# Altium project 50ohm-diff_converter.PrjPcb (part 1 of 3)
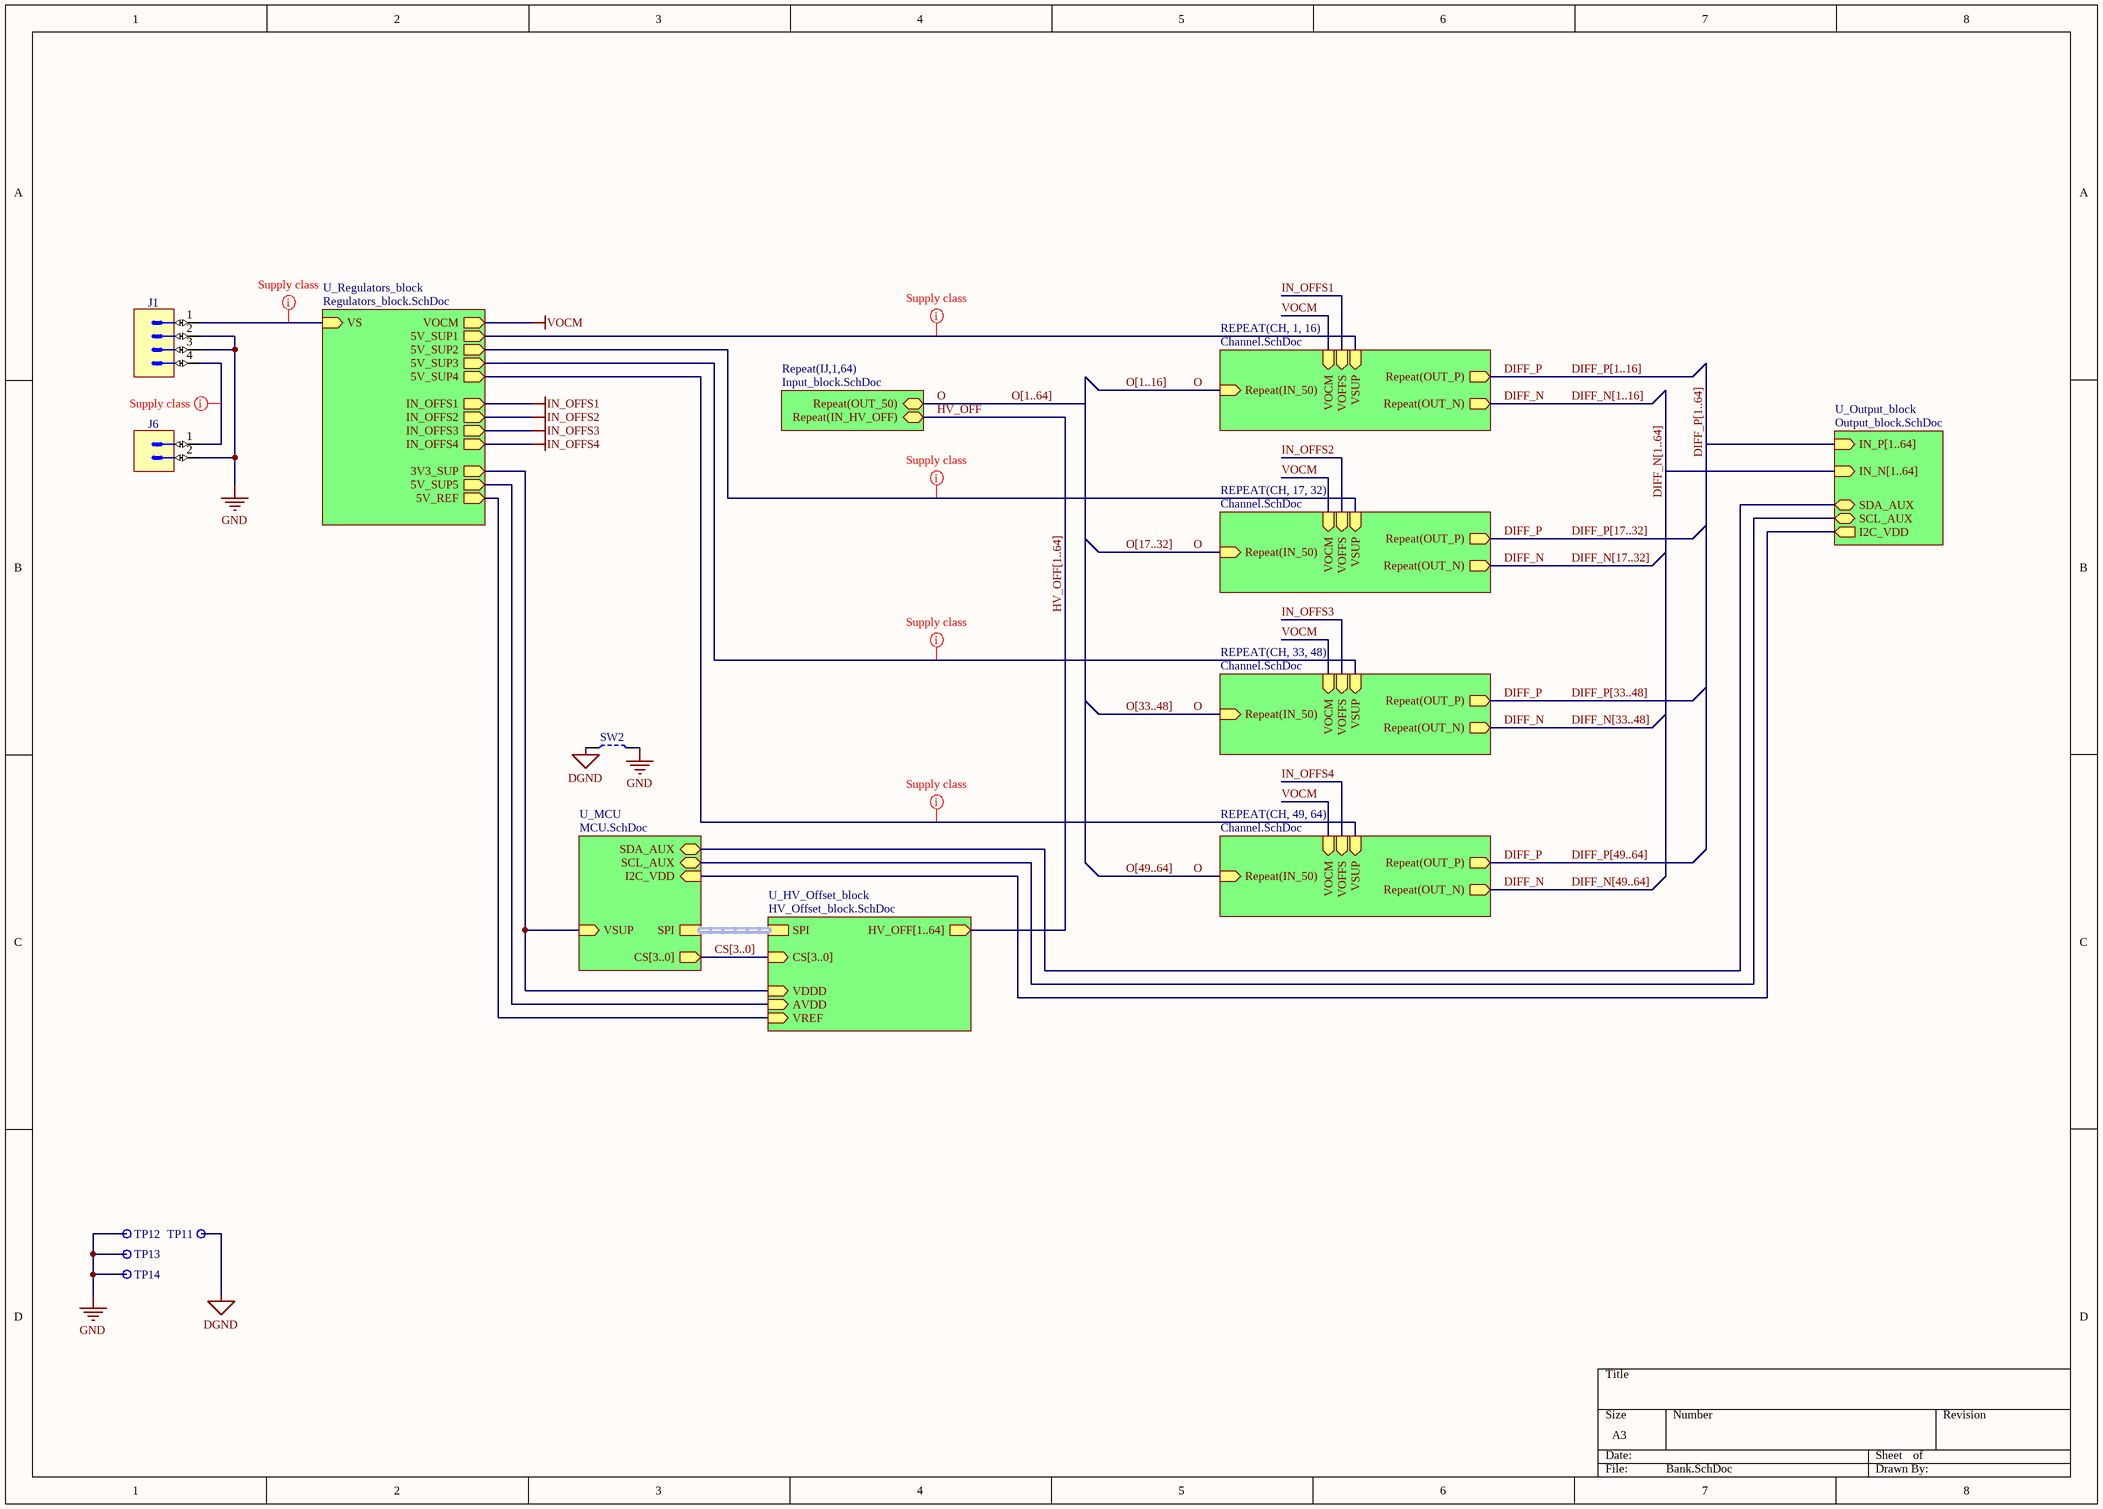
[diagram p0: Bank.SchDoc]
9 sheets, 1194 parts. Net scope: hierarchical (ports join the sheet entries above them; power ports are global).
Board file: PCB.PcbDoc
Sheets:
  Bank.SchDoc
    CH1 = Channel.SchDoc
    CH2 = Channel.SchDoc
    CH3 = Channel.SchDoc
    CH4 = Channel.SchDoc
    CH5 = Channel.SchDoc
    CH6 = Channel.SchDoc
    CH7 = Channel.SchDoc
    CH8 = Channel.SchDoc
    CH9 = Channel.SchDoc
    CH10 = Channel.SchDoc
    CH11 = Channel.SchDoc
    CH12 = Channel.SchDoc
    CH13 = Channel.SchDoc
    CH14 = Channel.SchDoc
    CH15 = Channel.SchDoc
    CH16 = Channel.SchDoc
    CH17 = Channel.SchDoc
    CH18 = Channel.SchDoc
    CH19 = Channel.SchDoc
    CH20 = Channel.SchDoc
    CH21 = Channel.SchDoc
    CH22 = Channel.SchDoc
    CH23 = Channel.SchDoc
    CH24 = Channel.SchDoc
    CH25 = Channel.SchDoc
    CH26 = Channel.SchDoc
    CH27 = Channel.SchDoc
    CH28 = Channel.SchDoc
    CH29 = Channel.SchDoc
    CH30 = Channel.SchDoc
    CH31 = Channel.SchDoc
    CH32 = Channel.SchDoc
    U_Output_block = Output_block.SchDoc
    CH33 = Channel.SchDoc
    CH34 = Channel.SchDoc
    CH35 = Channel.SchDoc
    CH36 = Channel.SchDoc
    CH37 = Channel.SchDoc
    CH38 = Channel.SchDoc
    CH39 = Channel.SchDoc
    CH40 = Channel.SchDoc
    CH41 = Channel.SchDoc
    CH42 = Channel.SchDoc
    CH43 = Channel.SchDoc
    CH44 = Channel.SchDoc
    CH45 = Channel.SchDoc
    CH46 = Channel.SchDoc
    CH47 = Channel.SchDoc
    CH48 = Channel.SchDoc
    CH49 = Channel.SchDoc
    CH50 = Channel.SchDoc
    CH51 = Channel.SchDoc
    CH52 = Channel.SchDoc
    CH53 = Channel.SchDoc
    CH54 = Channel.SchDoc
    CH55 = Channel.SchDoc
    CH56 = Channel.SchDoc
    CH57 = Channel.SchDoc
    CH58 = Channel.SchDoc
    CH59 = Channel.SchDoc
    CH60 = Channel.SchDoc
    CH61 = Channel.SchDoc
    CH62 = Channel.SchDoc
    CH63 = Channel.SchDoc
    CH64 = Channel.SchDoc
    U_HV_Offset_block = HV_Offset_block.SchDoc
      U_DAC_Bank_A = DAC_Bank.SchDoc
        U_DAC = DAC.SchDoc
        U_DAC = DAC.SchDoc
        U_DAC = DAC.SchDoc
        U_DAC = DAC.SchDoc
      U_DAC_Bank_B = DAC_Bank.SchDoc
        U_DAC = DAC.SchDoc
        U_DAC = DAC.SchDoc
        U_DAC = DAC.SchDoc
        U_DAC = DAC.SchDoc
      U_DAC_Bank_C = DAC_Bank.SchDoc
        U_DAC = DAC.SchDoc
        U_DAC = DAC.SchDoc
        U_DAC = DAC.SchDoc
        U_DAC = DAC.SchDoc
      U_DAC_Bank_D = DAC_Bank.SchDoc
        U_DAC = DAC.SchDoc
        U_DAC = DAC.SchDoc
        U_DAC = DAC.SchDoc
        U_DAC = DAC.SchDoc
    IJ1 = Input_block.SchDoc
    IJ2 = Input_block.SchDoc
    IJ3 = Input_block.SchDoc
    IJ4 = Input_block.SchDoc
    IJ5 = Input_block.SchDoc
    IJ6 = Input_block.SchDoc
    IJ7 = Input_block.SchDoc
    IJ8 = Input_block.SchDoc
    IJ9 = Input_block.SchDoc
    IJ10 = Input_block.SchDoc
    IJ11 = Input_block.SchDoc
    IJ12 = Input_block.SchDoc
    IJ13 = Input_block.SchDoc
    IJ14 = Input_block.SchDoc
    IJ15 = Input_block.SchDoc
    IJ16 = Input_block.SchDoc
    IJ17 = Input_block.SchDoc
    IJ18 = Input_block.SchDoc
    IJ19 = Input_block.SchDoc
    IJ20 = Input_block.SchDoc
    IJ21 = Input_block.SchDoc
    IJ22 = Input_block.SchDoc
    IJ23 = Input_block.SchDoc
    IJ24 = Input_block.SchDoc
    IJ25 = Input_block.SchDoc
    IJ26 = Input_block.SchDoc
    IJ27 = Input_block.SchDoc
    IJ28 = Input_block.SchDoc
    IJ29 = Input_block.SchDoc
    IJ30 = Input_block.SchDoc
    IJ31 = Input_block.SchDoc
    IJ32 = Input_block.SchDoc
    IJ33 = Input_block.SchDoc
    IJ34 = Input_block.SchDoc
    IJ35 = Input_block.SchDoc
    IJ36 = Input_block.SchDoc
    IJ37 = Input_block.SchDoc
    IJ38 = Input_block.SchDoc
    IJ39 = Input_block.SchDoc
    IJ40 = Input_block.SchDoc
    IJ41 = Input_block.SchDoc
    IJ42 = Input_block.SchDoc
    IJ43 = Input_block.SchDoc
    IJ44 = Input_block.SchDoc
    IJ45 = Input_block.SchDoc
    IJ46 = Input_block.SchDoc
    IJ47 = Input_block.SchDoc
    IJ48 = Input_block.SchDoc
    IJ49 = Input_block.SchDoc
    IJ50 = Input_block.SchDoc
    IJ51 = Input_block.SchDoc
    IJ52 = Input_block.SchDoc
    IJ53 = Input_block.SchDoc
    IJ54 = Input_block.SchDoc
    IJ55 = Input_block.SchDoc
    IJ56 = Input_block.SchDoc
    IJ57 = Input_block.SchDoc
    IJ58 = Input_block.SchDoc
    IJ59 = Input_block.SchDoc
    IJ60 = Input_block.SchDoc
    IJ61 = Input_block.SchDoc
    IJ62 = Input_block.SchDoc
    IJ63 = Input_block.SchDoc
    IJ64 = Input_block.SchDoc
    U_MCU = MCU.SchDoc
    U_Regulators_block = Regulators_block.SchDoc

## Sheet Bank.SchDoc
size A3

### Parts
J1  Header 4  [WURTH_691 313 410 004]  (value not drawn)
J6  KK®  [MOLEX_22-04-1021]  (value not drawn)
SW2  Switch  [JUMPSMD0805_G50]  (value not drawn)
TP11  Test Point  [VERO_20-313145]  (value not drawn)
TP12  Test Point  [VERO_20-313145]  (value not drawn)
TP13  Test Point  [VERO_20-313145]  (value not drawn)
TP14  Test Point  [VERO_20-313145]  (value not drawn)

### Sub-sheets
REPEAT(CH, 1, 16) = Channel.SchDoc: Repeat(OUT_N) (out), Repeat(OUT_P) (out), VSUP (in), Repeat(IN_50) (in), VOFFS (in), VOCM (in)
REPEAT(CH, 17, 32) = Channel.SchDoc: Repeat(OUT_N) (out), Repeat(OUT_P) (out), VSUP (in), Repeat(IN_50) (in), VOCM (in), VOFFS (in)
REPEAT(CH, 33, 48) = Channel.SchDoc: Repeat(OUT_N) (out), Repeat(OUT_P) (out), VSUP (in), Repeat(IN_50) (in), VOCM (in), VOFFS (in)
REPEAT(CH, 49, 64) = Channel.SchDoc: Repeat(OUT_N) (out), Repeat(OUT_P) (out), VSUP (in), Repeat(IN_50) (in), VOCM (in), VOFFS (in)
Repeat(IJ,1,64) = Input_block.SchDoc: Repeat(OUT_50) (bidir), Repeat(IN_HV_OFF) (bidir)
U_HV_Offset_block = HV_Offset_block.SchDoc: SPI (harness SPI), CS[3..0] (in), HV_OFF[1..64] (out), VDDD (in), AVDD (in), VREF (in)
U_MCU = MCU.SchDoc: CS[3..0] (out), VSUP (in), SPI (harness SPI), SDA_AUX (bidir), SCL_AUX (bidir), I2C_VDD (in)
U_Output_block = Output_block.SchDoc: IN_P[1..64] (in), IN_N[1..64] (in), I2C_VDD (out), SCL_AUX (bidir), SDA_AUX (bidir)
U_Regulators_block = Regulators_block.SchDoc: VS (in), IN_OFFS3 (out), 5V_SUP2 (out), VOCM (out), 5V_SUP4 (out), 5V_REF (out), IN_OFFS2 (out), 3V3_SUP (out), 5V_SUP3 (out), IN_OFFS1 (out), IN_OFFS4 (out), 5V_SUP1 (out), 5V_SUP5 (out)

### Nets
5V_SUP1: sheet REPEAT(CH, 1, 16)/VSUP, sheet U_Regulators_block/5V_SUP1
5V_SUP2: sheet REPEAT(CH, 17, 32)/VSUP, sheet U_Regulators_block/5V_SUP2
5V_SUP3: sheet REPEAT(CH, 33, 48)/VSUP, sheet U_Regulators_block/5V_SUP3
5V_SUP4: sheet REPEAT(CH, 49, 64)/VSUP, sheet U_Regulators_block/5V_SUP4
DGND: SW2.1 TP11.1
GND: J1.2 J1.3 J6.2 SW2.2 TP12.1 TP13.1 TP14.1
IN_OFFS1: sheet REPEAT(CH, 1, 16)/VOFFS, sheet U_Regulators_block/IN_OFFS1
IN_OFFS2: sheet REPEAT(CH, 17, 32)/VOFFS, sheet U_Regulators_block/IN_OFFS2
IN_OFFS3: sheet REPEAT(CH, 33, 48)/VOFFS, sheet U_Regulators_block/IN_OFFS3
IN_OFFS4: sheet REPEAT(CH, 49, 64)/VOFFS, sheet U_Regulators_block/IN_OFFS4
VDD: sheet U_HV_Offset_block/VDDD, sheet U_MCU/VSUP, sheet U_Regulators_block/3V3_SUP
VOCM: sheet REPEAT(CH, 1, 16)/VOCM, sheet REPEAT(CH, 17, 32)/VOCM, sheet REPEAT(CH, 33, 48)/VOCM, sheet REPEAT(CH, 49, 64)/VOCM, sheet U_Regulators_block/VOCM
DIFF_N: sheet REPEAT(CH, 1, 16)/Repeat(OUT_N), sheet REPEAT(CH, 17, 32)/Repeat(OUT_N), sheet REPEAT(CH, 33, 48)/Repeat(OUT_N), sheet REPEAT(CH, 49, 64)/Repeat(OUT_N)
DIFF_P: sheet REPEAT(CH, 1, 16)/Repeat(OUT_P), sheet REPEAT(CH, 17, 32)/Repeat(OUT_P), sheet REPEAT(CH, 33, 48)/Repeat(OUT_P), sheet REPEAT(CH, 49, 64)/Repeat(OUT_P)
HV_OFF: sheet Repeat(IJ,1,64)/Repeat(IN_HV_OFF)
O: sheet REPEAT(CH, 1, 16)/Repeat(IN_50), sheet REPEAT(CH, 17, 32)/Repeat(IN_50), sheet REPEAT(CH, 33, 48)/Repeat(IN_50), sheet REPEAT(CH, 49, 64)/Repeat(IN_50), sheet Repeat(IJ,1,64)/Repeat(OUT_50)
VS: J1.1 ; sheet U_Regulators_block/VS
NetC12_2: sheet U_HV_Offset_block/AVDD, sheet U_Regulators_block/5V_SUP5
NetC47_2: sheet U_Output_block/I2C_VDD, sheet U_MCU/I2C_VDD
NetIC9_6: sheet U_Output_block/SDA_AUX, sheet U_MCU/SDA_AUX
NetIC9_7: sheet U_Output_block/SCL_AUX, sheet U_MCU/SCL_AUX
NetJ1_4: J1.4 J6.1
NetL15_2: sheet U_HV_Offset_block/VREF, sheet U_Regulators_block/5V_REF

### Buses and harness runs
bus CS[3..0] = sheet U_HV_Offset_block/CS[3..0] = sheet U_MCU/CS[3..0]
bus DIFF_N[1..16]
bus DIFF_N[1..64] = sheet U_Output_block/IN_N[1..64]
bus DIFF_N[17..32]
bus DIFF_N[33..48]
bus DIFF_N[49..64]
bus DIFF_P[1..16]
bus DIFF_P[1..64] = sheet U_Output_block/IN_P[1..64]
bus DIFF_P[17..32]
bus DIFF_P[33..48]
bus DIFF_P[49..64]
bus HV_OFF[1..64] = sheet U_HV_Offset_block/HV_OFF[1..64]
bus O[1..16]
bus O[1..64]
bus O[17..32]
bus O[33..48]
bus O[49..64]
harness sheet U_HV_Offset_block/SPI = sheet U_MCU/SPI

### Layout directives
net class Supply: 5V_SUP1, 5V_SUP2, 5V_SUP3, 5V_SUP4, NetJ1_4, VS

### Library data of the parts
J1 = WURTH_691 313 410 004: Connector 4 Male; Part Description: 4 Contacts, Single Row, Right Angled Serie 3134-7.62mm; Manufacturer: WURTH ELEKTRONIK; PressFit: No; Part Number: WURTH_691 313 410 004; Component Kind: Standard; Component Type: Standard; Pin Count: 4; Family: Header 4; Mounted: Yes; Socket: No; SMD: No; Sense: No; Status: None; Manufacturer Part Number: 691 313 410 004; ComponentHeight: 8.5mm; HelpURL: \\cern.ch\dfs\Applications\Altium\Datasheets\WURTH_691 313 410 004.pdf; Author: CERN DEM MR; CreateDate: 08.04.2016; LatestRevisionDate: 08.04.2016
J6 = MOLEX_22-04-1021: Connector 2 Male; Part Description: 2.5mm (.100") Pitch KK® Wire-to-Board Header, Vertical, with Friction Lock, 2 Circuits, Tin (Sn) Plating; Manufacturer: MOLEX; PressFit: No; Part Number: MOLEX_22-04-1021; Component Kind: Standard; Component Type: Standard; Pin Count: 2; Family: KK®; Mounted: Yes; Socket: No; SMD: No; Sense: No; Status: None; Manufacturer Part Number: 22-04-1021; ComponentHeight: 11.7mm; HelpURL: \\cern.ch\dfs\Applications\Altium\Datasheets\MOLEX_22-04-1021.pdf; Author: CERN DEM JLC; CreateDate: 09.02.2012; LatestRevisionDate: 09.02.2012
SW2 = JUMPSMD0805_G50: 2 SMD Pads for Bound by Solder  Drop; Part Description: 2 SMD Pads for Bound by Solder Drop - Equivalent Size 0805 - Gap 0.5mm; Manufacturer: None; Mounted: No; PressFit: No; Part Number: JUMPSMD0805_G50; Component Kind: Standard (No BOM); Component Type: Standard (No BOM); Pin Count: 2; PackageDescription: 2 SMD Pads for Bound by Solder Drop - Equivalent Size 0805 - Gap 0.5mm; Family: Switch; Socket: No; SMD: Yes; Sense: No; Status: None; Manufacturer Part Number: None; ComponentHeight: 0mm; HelpURL: None; Author: CERN DEM JLC; CreateDate: 26.08.2009; LatestRevisionDate: 09.09.2009
TP11-TP14 = VERO_20-313145: Part Description: Black Bead PCB Terminal Test Pin for 2.4mm PCB Thickness (1.32mm Hole); Manufacturer: VERO TECHNOLOGIES; PressFit: No; Part Number: VERO_20-313145; Component Kind: Standard; Component Type: Standard; Pin Count: 1; Family: Test Point; Mounted: Yes; Socket: No; SMD: No; Sense: No; Status: None; Manufacturer Part Number: 20-313145; ComponentHeight: 5.3mm; HelpURL: \\cern.ch\dfs\Applications\Altium\Datasheets\VERO_20-313145.pdf; Author: CERN DEM JLC; CreateDate: 15.07.2013; LatestRevisionDate: 15.07.2013

## Sheet Channel.SchDoc
size A4
Used 64 times, as channels CH1, CH2, CH3, CH4, CH5, CH6, CH7, CH8, CH9, CH10, CH11, CH12, CH13, CH14, CH15, CH16, CH17, CH18, CH19, CH20, CH21, CH22, CH23, CH24, CH25, CH26, CH27, CH28, CH29, CH30, CH31, CH32, CH33, CH34, CH35, CH36, CH37, CH38, CH39, CH40, CH41, CH42, CH43, CH44, CH45, CH46, CH47, CH48, CH49, CH50, CH51, CH52, CH53, CH54, CH55, CH56, CH57, CH58, CH59, CH60, CH61, CH62, CH63, CH64. Parts and nets are listed once, with the designators drawn on the sheet.
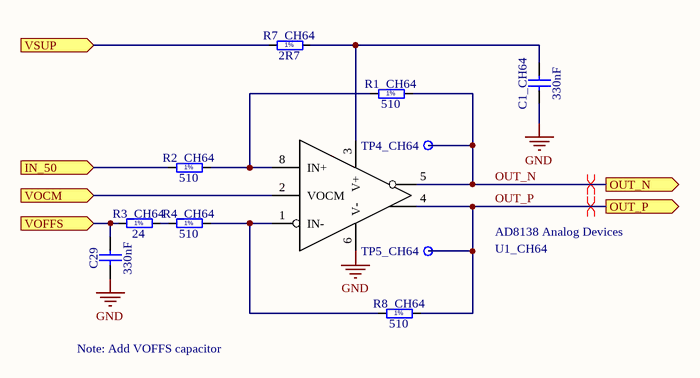
[diagram p1: Channel.SchDoc]

### Parts
C1_CH64  330nF  [CAPC2012X135N]
C29  330nF  [CAPC2012X135N]
R1_CH64  510  [RESC2012X60N]
R2_CH64  510  [RESC2012X60N]
R3_CH64  24  [RESC2012X60N]
R4_CH64  510  [RESC2012X60N]
R7_CH64  2R7  [RESC2012X60N]
R8_CH64  510  [RESC2012X60N]
TP4_CH64  Test Point  [Testpoint]  (value not drawn)
TP5_CH64  Test Point  [Testpoint]  (value not drawn)
U1_CH64  AD8138 Analog Devices  [SOIC127P600X175-8N]

### Ports
IN_50 (in), OUT_N (out), OUT_P (out), VOCM (in), VOFFS (in), VSUP (in)

### Nets
GND: C1_CH64.1 C29.1 U1_CH64.6(V-)
IN_50: R2_CH64.1 ; port IN_50
OUT_N: R1_CH64.2 TP4_CH64.1 U1_CH64.5(OUT-) ; port OUT_N
OUT_P: R8_CH64.2 TP5_CH64.1 U1_CH64.4(OUT+) ; port OUT_P
VOCM: U1_CH64.2(VOCM) ; port VOCM
VOFFS: C29.2 R3_CH64.1 ; port VOFFS
VSUP: R7_CH64.1 ; port VSUP
NetC1_CH64_2: C1_CH64.2 R7_CH64.2 U1_CH64.3(V+)
NetR1_CH64_1: R1_CH64.1 R2_CH64.2 U1_CH64.8(IN+)
NetR3_CH64_2: R3_CH64.2 R4_CH64.1
NetR4_CH64_2: R4_CH64.2 R8_CH64.1 U1_CH64.1(IN-)

### Channels
CH1: designators end in _1; ports IN_50=O1 OUT_N=DIFF_N1 OUT_P=DIFF_P1 VOCM=VOCM VOFFS=IN_OFFS1 VSUP=5V_SUP1
CH2: designators end in _2; ports IN_50=O2 OUT_N=DIFF_N2 OUT_P=DIFF_P2 VOCM=VOCM VOFFS=IN_OFFS1 VSUP=5V_SUP1
CH3: designators end in _3; ports IN_50=O3 OUT_N=DIFF_N3 OUT_P=DIFF_P3 VOCM=VOCM VOFFS=IN_OFFS1 VSUP=5V_SUP1
CH4: designators end in _4; ports IN_50=O4 OUT_N=DIFF_N4 OUT_P=DIFF_P4 VOCM=VOCM VOFFS=IN_OFFS1 VSUP=5V_SUP1
CH5: designators end in _5; ports IN_50=O5 OUT_N=DIFF_N5 OUT_P=DIFF_P5 VOCM=VOCM VOFFS=IN_OFFS1 VSUP=5V_SUP1
CH6: designators end in _6; ports IN_50=O6 OUT_N=DIFF_N6 OUT_P=DIFF_P6 VOCM=VOCM VOFFS=IN_OFFS1 VSUP=5V_SUP1
CH7: designators end in _7; ports IN_50=O7 OUT_N=DIFF_N7 OUT_P=DIFF_P7 VOCM=VOCM VOFFS=IN_OFFS1 VSUP=5V_SUP1
CH8: designators end in _8; ports IN_50=O8 OUT_N=DIFF_N8 OUT_P=DIFF_P8 VOCM=VOCM VOFFS=IN_OFFS1 VSUP=5V_SUP1
CH9: designators end in _9; ports IN_50=O9 OUT_N=DIFF_N9 OUT_P=DIFF_P9 VOCM=VOCM VOFFS=IN_OFFS1 VSUP=5V_SUP1
CH10: designators end in _10; ports IN_50=O10 OUT_N=DIFF_N10 OUT_P=DIFF_P10 VOCM=VOCM VOFFS=IN_OFFS1 VSUP=5V_SUP1
CH11: designators end in _11; ports IN_50=O11 OUT_N=DIFF_N11 OUT_P=DIFF_P11 VOCM=VOCM VOFFS=IN_OFFS1 VSUP=5V_SUP1
CH12: designators end in _12; ports IN_50=O12 OUT_N=DIFF_N12 OUT_P=DIFF_P12 VOCM=VOCM VOFFS=IN_OFFS1 VSUP=5V_SUP1
CH13: designators end in _13; ports IN_50=O13 OUT_N=DIFF_N13 OUT_P=DIFF_P13 VOCM=VOCM VOFFS=IN_OFFS1 VSUP=5V_SUP1
CH14: designators end in _14; ports IN_50=O14 OUT_N=DIFF_N14 OUT_P=DIFF_P14 VOCM=VOCM VOFFS=IN_OFFS1 VSUP=5V_SUP1
CH15: designators end in _15; ports IN_50=O15 OUT_N=DIFF_N15 OUT_P=DIFF_P15 VOCM=VOCM VOFFS=IN_OFFS1 VSUP=5V_SUP1
CH16: designators end in _16; ports IN_50=O16 OUT_N=DIFF_N16 OUT_P=DIFF_P16 VOCM=VOCM VOFFS=IN_OFFS1 VSUP=5V_SUP1
CH17: designators end in _17; ports IN_50=O17 OUT_N=DIFF_N17 OUT_P=DIFF_P17 VOCM=VOCM VOFFS=IN_OFFS2 VSUP=5V_SUP2
CH18: designators end in _18; ports IN_50=O18 OUT_N=DIFF_N18 OUT_P=DIFF_P18 VOCM=VOCM VOFFS=IN_OFFS2 VSUP=5V_SUP2
CH19: designators end in _19; ports IN_50=O19 OUT_N=DIFF_N19 OUT_P=DIFF_P19 VOCM=VOCM VOFFS=IN_OFFS2 VSUP=5V_SUP2
CH20: designators end in _20; ports IN_50=O20 OUT_N=DIFF_N20 OUT_P=DIFF_P20 VOCM=VOCM VOFFS=IN_OFFS2 VSUP=5V_SUP2
CH21: designators end in _21; ports IN_50=O21 OUT_N=DIFF_N21 OUT_P=DIFF_P21 VOCM=VOCM VOFFS=IN_OFFS2 VSUP=5V_SUP2
CH22: designators end in _22; ports IN_50=O22 OUT_N=DIFF_N22 OUT_P=DIFF_P22 VOCM=VOCM VOFFS=IN_OFFS2 VSUP=5V_SUP2
CH23: designators end in _23; ports IN_50=O23 OUT_N=DIFF_N23 OUT_P=DIFF_P23 VOCM=VOCM VOFFS=IN_OFFS2 VSUP=5V_SUP2
CH24: designators end in _24; ports IN_50=O24 OUT_N=DIFF_N24 OUT_P=DIFF_P24 VOCM=VOCM VOFFS=IN_OFFS2 VSUP=5V_SUP2
CH25: designators end in _25; ports IN_50=O25 OUT_N=DIFF_N25 OUT_P=DIFF_P25 VOCM=VOCM VOFFS=IN_OFFS2 VSUP=5V_SUP2
CH26: designators end in _26; ports IN_50=O26 OUT_N=DIFF_N26 OUT_P=DIFF_P26 VOCM=VOCM VOFFS=IN_OFFS2 VSUP=5V_SUP2
CH27: designators end in _27; ports IN_50=O27 OUT_N=DIFF_N27 OUT_P=DIFF_P27 VOCM=VOCM VOFFS=IN_OFFS2 VSUP=5V_SUP2
CH28: designators end in _28; ports IN_50=O28 OUT_N=DIFF_N28 OUT_P=DIFF_P28 VOCM=VOCM VOFFS=IN_OFFS2 VSUP=5V_SUP2
CH29: designators end in _29; ports IN_50=O29 OUT_N=DIFF_N29 OUT_P=DIFF_P29 VOCM=VOCM VOFFS=IN_OFFS2 VSUP=5V_SUP2
CH30: designators end in _30; ports IN_50=O30 OUT_N=DIFF_N30 OUT_P=DIFF_P30 VOCM=VOCM VOFFS=IN_OFFS2 VSUP=5V_SUP2
CH31: designators end in _31; ports IN_50=O31 OUT_N=DIFF_N31 OUT_P=DIFF_P31 VOCM=VOCM VOFFS=IN_OFFS2 VSUP=5V_SUP2
CH32: designators end in _32; ports IN_50=O32 OUT_N=DIFF_N32 OUT_P=DIFF_P32 VOCM=VOCM VOFFS=IN_OFFS2 VSUP=5V_SUP2
CH33: designators end in _33; ports IN_50=O33 OUT_N=DIFF_N33 OUT_P=DIFF_P33 VOCM=VOCM VOFFS=IN_OFFS3 VSUP=5V_SUP3
CH34: designators end in _34; ports IN_50=O34 OUT_N=DIFF_N34 OUT_P=DIFF_P34 VOCM=VOCM VOFFS=IN_OFFS3 VSUP=5V_SUP3
CH35: designators end in _35; ports IN_50=O35 OUT_N=DIFF_N35 OUT_P=DIFF_P35 VOCM=VOCM VOFFS=IN_OFFS3 VSUP=5V_SUP3
CH36: designators end in _36; ports IN_50=O36 OUT_N=DIFF_N36 OUT_P=DIFF_P36 VOCM=VOCM VOFFS=IN_OFFS3 VSUP=5V_SUP3
CH37: designators end in _37; ports IN_50=O37 OUT_N=DIFF_N37 OUT_P=DIFF_P37 VOCM=VOCM VOFFS=IN_OFFS3 VSUP=5V_SUP3
CH38: designators end in _38; ports IN_50=O38 OUT_N=DIFF_N38 OUT_P=DIFF_P38 VOCM=VOCM VOFFS=IN_OFFS3 VSUP=5V_SUP3
CH39: designators end in _39; ports IN_50=O39 OUT_N=DIFF_N39 OUT_P=DIFF_P39 VOCM=VOCM VOFFS=IN_OFFS3 VSUP=5V_SUP3
CH40: designators end in _40; ports IN_50=O40 OUT_N=DIFF_N40 OUT_P=DIFF_P40 VOCM=VOCM VOFFS=IN_OFFS3 VSUP=5V_SUP3
CH41: designators end in _41; ports IN_50=O41 OUT_N=DIFF_N41 OUT_P=DIFF_P41 VOCM=VOCM VOFFS=IN_OFFS3 VSUP=5V_SUP3
CH42: designators end in _42; ports IN_50=O42 OUT_N=DIFF_N42 OUT_P=DIFF_P42 VOCM=VOCM VOFFS=IN_OFFS3 VSUP=5V_SUP3
CH43: designators end in _43; ports IN_50=O43 OUT_N=DIFF_N43 OUT_P=DIFF_P43 VOCM=VOCM VOFFS=IN_OFFS3 VSUP=5V_SUP3
CH44: designators end in _44; ports IN_50=O44 OUT_N=DIFF_N44 OUT_P=DIFF_P44 VOCM=VOCM VOFFS=IN_OFFS3 VSUP=5V_SUP3
CH45: designators end in _45; ports IN_50=O45 OUT_N=DIFF_N45 OUT_P=DIFF_P45 VOCM=VOCM VOFFS=IN_OFFS3 VSUP=5V_SUP3
CH46: designators end in _46; ports IN_50=O46 OUT_N=DIFF_N46 OUT_P=DIFF_P46 VOCM=VOCM VOFFS=IN_OFFS3 VSUP=5V_SUP3
CH47: designators end in _47; ports IN_50=O47 OUT_N=DIFF_N47 OUT_P=DIFF_P47 VOCM=VOCM VOFFS=IN_OFFS3 VSUP=5V_SUP3
CH48: designators end in _48; ports IN_50=O48 OUT_N=DIFF_N48 OUT_P=DIFF_P48 VOCM=VOCM VOFFS=IN_OFFS3 VSUP=5V_SUP3
CH49: designators end in _49; ports IN_50=O49 OUT_N=DIFF_N49 OUT_P=DIFF_P49 VOCM=VOCM VOFFS=IN_OFFS4 VSUP=5V_SUP4
CH50: designators end in _50; ports IN_50=O50 OUT_N=DIFF_N50 OUT_P=DIFF_P50 VOCM=VOCM VOFFS=IN_OFFS4 VSUP=5V_SUP4
CH51: designators end in _51; ports IN_50=O51 OUT_N=DIFF_N51 OUT_P=DIFF_P51 VOCM=VOCM VOFFS=IN_OFFS4 VSUP=5V_SUP4
CH52: designators end in _52; ports IN_50=O52 OUT_N=DIFF_N52 OUT_P=DIFF_P52 VOCM=VOCM VOFFS=IN_OFFS4 VSUP=5V_SUP4
CH53: designators end in _53; ports IN_50=O53 OUT_N=DIFF_N53 OUT_P=DIFF_P53 VOCM=VOCM VOFFS=IN_OFFS4 VSUP=5V_SUP4
CH54: designators end in _54; ports IN_50=O54 OUT_N=DIFF_N54 OUT_P=DIFF_P54 VOCM=VOCM VOFFS=IN_OFFS4 VSUP=5V_SUP4
CH55: designators end in _55; ports IN_50=O55 OUT_N=DIFF_N55 OUT_P=DIFF_P55 VOCM=VOCM VOFFS=IN_OFFS4 VSUP=5V_SUP4
CH56: designators end in _56; ports IN_50=O56 OUT_N=DIFF_N56 OUT_P=DIFF_P56 VOCM=VOCM VOFFS=IN_OFFS4 VSUP=5V_SUP4
CH57: designators end in _57; ports IN_50=O57 OUT_N=DIFF_N57 OUT_P=DIFF_P57 VOCM=VOCM VOFFS=IN_OFFS4 VSUP=5V_SUP4
CH58: designators end in _58; ports IN_50=O58 OUT_N=DIFF_N58 OUT_P=DIFF_P58 VOCM=VOCM VOFFS=IN_OFFS4 VSUP=5V_SUP4
CH59: designators end in _59; ports IN_50=O59 OUT_N=DIFF_N59 OUT_P=DIFF_P59 VOCM=VOCM VOFFS=IN_OFFS4 VSUP=5V_SUP4
CH60: designators end in _60; ports IN_50=O60 OUT_N=DIFF_N60 OUT_P=DIFF_P60 VOCM=VOCM VOFFS=IN_OFFS4 VSUP=5V_SUP4
CH61: designators end in _61; ports IN_50=O61 OUT_N=DIFF_N61 OUT_P=DIFF_P61 VOCM=VOCM VOFFS=IN_OFFS4 VSUP=5V_SUP4
CH62: designators end in _62; ports IN_50=O62 OUT_N=DIFF_N62 OUT_P=DIFF_P62 VOCM=VOCM VOFFS=IN_OFFS4 VSUP=5V_SUP4
CH63: designators end in _63; ports IN_50=O63 OUT_N=DIFF_N63 OUT_P=DIFF_P63 VOCM=VOCM VOFFS=IN_OFFS4 VSUP=5V_SUP4
CH64: designators end in _64; ports IN_50=O64 OUT_N=DIFF_N64 OUT_P=DIFF_P64 VOCM=VOCM VOFFS=IN_OFFS4 VSUP=5V_SUP4

### Layout directives
differential pair: DIFF_N1, DIFF_P1

### Notes on the sheet
- Note: Add VOFFS capacitor
- (in symbol R0805_2R7_1%_0.125W_200PPM) 1%
- (in symbol R0805_24R_1%_0.125W_100PPM) 1%
- (in symbol R0805_510R_1%_0.125W_100PPM) 1%

### Library data of the parts
C1_CH64 C29 = CC0805_330NF_16V_10%_X7R: Non-polarised capacitor; Part Description: SMD Multilayer Chip Ceramic Capacitor; Manufacturer: GENERIC; Manufacturer1 Part Number: CC0805KKX7R7BB334; Voltage: 16V; TC: X7R; Tolerance: ±10%; Part Number: CC0805_330NF_16V_10%_X7R; Component Kind: Standard; Component Type: Standard; Pin Count: 2; Value: 330nF; Status: Preferred; Manufacturer Part Number: CC0805_330NF_16V_10%_X7R; Case: 0805; Mounted: Yes; Socket: No; SMD: Yes; Sense: No; Manufacturer1 Example: YAGEO; Manufacturer1 ComponentHeight: 1.45mm; HelpURL: \\cern.ch\dfs\Applications\Altium\Datasheets\CC0805_X7R_YAGEO_HIGH CAPACITANCE_MAX50V.pdf; Author: CERN DEM JLC; CreateDate: 03.12.2007; LatestRevisionDate: 21.04.2015
R1_CH64 R2_CH64 R4_CH64 R8_CH64 = R0805_510R_1%_0.125W_100PPM: Resistor - 1%; Part Description: General Purpose Thick Film Chip Resistor; Manufacturer: GENERIC; Manufacturer1 Part Number: NRC10F5100TRF; Power: 0.125W; TC: ±100ppm/°C; PressFit: No; Part Number: R0805_510R_1%_0.125W_100PPM; Component Kind: Standard; Component Type: Standard; Pin Count: 2; Value: 510; Status: Preferred; Tolerance: ±1%; Manufacturer Part Number: R0805_510R_1%_0.125W_100PPM; Case: 0805; Mounted: Yes; Sense: No; Socket: No; SMD: Yes; Manufacturer1 Example: NIC COMPONENT; Manufacturer1 ComponentHeight: 0.6mm; HelpURL: \\cern.ch\dfs\Applications\Altium\Datasheets\R0805_NIC_NRC.pdf; Author: CERN DEM JLC; CreateDate: 03.12.2007; LatestRevisionDate: 13.03.2008
R3_CH64 = R0805_24R_1%_0.125W_100PPM: Resistor - 1%; Part Description: General Purpose Thick Film Chip Resistor; Manufacturer: GENERIC; Manufacturer1 Part Number: NRC10F24R0TRF; Power: 0.125W; TC: ±100ppm/°C; PressFit: No; Part Number: R0805_24R_1%_0.125W_100PPM; Component Kind: Standard; Component Type: Standard; Pin Count: 2; Value: 24; Status: Preferred; Tolerance: ±1%; Manufacturer Part Number: R0805_24R_1%_0.125W_100PPM; Case: 0805; Mounted: Yes; Sense: No; Socket: No; SMD: Yes; Manufacturer1 Example: NIC COMPONENT; Manufacturer1 ComponentHeight: 0.6mm; HelpURL: \\cern.ch\dfs\Applications\Altium\Datasheets\R0805_NIC_NRC.pdf; Author: CERN DEM JLC; CreateDate: 03.12.2007; LatestRevisionDate: 13.03.2008
R7_CH64 = R0805_2R7_1%_0.125W_200PPM: Resistor - 1%; Part Description: General Purpose Thick Film Chip Resistor; Manufacturer: GENERIC; Manufacturer1 Part Number: 232273462708L or RC0805FR-072R7L; Power: 0.125W; TC: ±200ppm/°C; PressFit: No; Part Number: R0805_2R7_1%_0.125W_200PPM; Component Kind: Standard; Component Type: Standard; Pin Count: 2; Value: 2R7; Status: Preferred; Tolerance: ±1%; Manufacturer Part Number: R0805_2R7_1%_0.125W_200PPM; Case: 0805; Mounted: Yes; Sense: No; Socket: No; SMD: Yes; Manufacturer1 Example: YAGEO PHYCOMP; Manufacturer1 ComponentHeight: 0.65mm; HelpURL: \\cern.ch\dfs\Applications\Altium\Datasheets\R0805_Phycomp_RC0805.pdf; Author: CERN DEM JLC; CreateDate: 03.12.2007; LatestRevisionDate: 17.10.2012
TP4_CH64 TP5_CH64 = VERO_20-313145: as TP11 on sheet Bank; Part Number: VERO_20-313145; Component Kind: Standard; Component Type: Standard; Footprint: VERO_20-313145; Pin Count: 1; Family: Test Point; Mounted: Yes; Socket: No; SMD: No; Sense: No; Status: None; Manufacturer Part Number: 20-313145; ComponentHeight: 5.3mm; HelpURL: \\cern.ch\dfs\Applications\Altium\Datasheets\VERO_20-313145.pdf; Author: CERN DEM JLC; CreateDate: 15.07.2013; LatestRevisionDate: 15.07.2013
U1_CH64 = AD8138: Manufacturer: Analog Devices; Name: AD8138

## Sheet Output_block.SchDoc
size A3
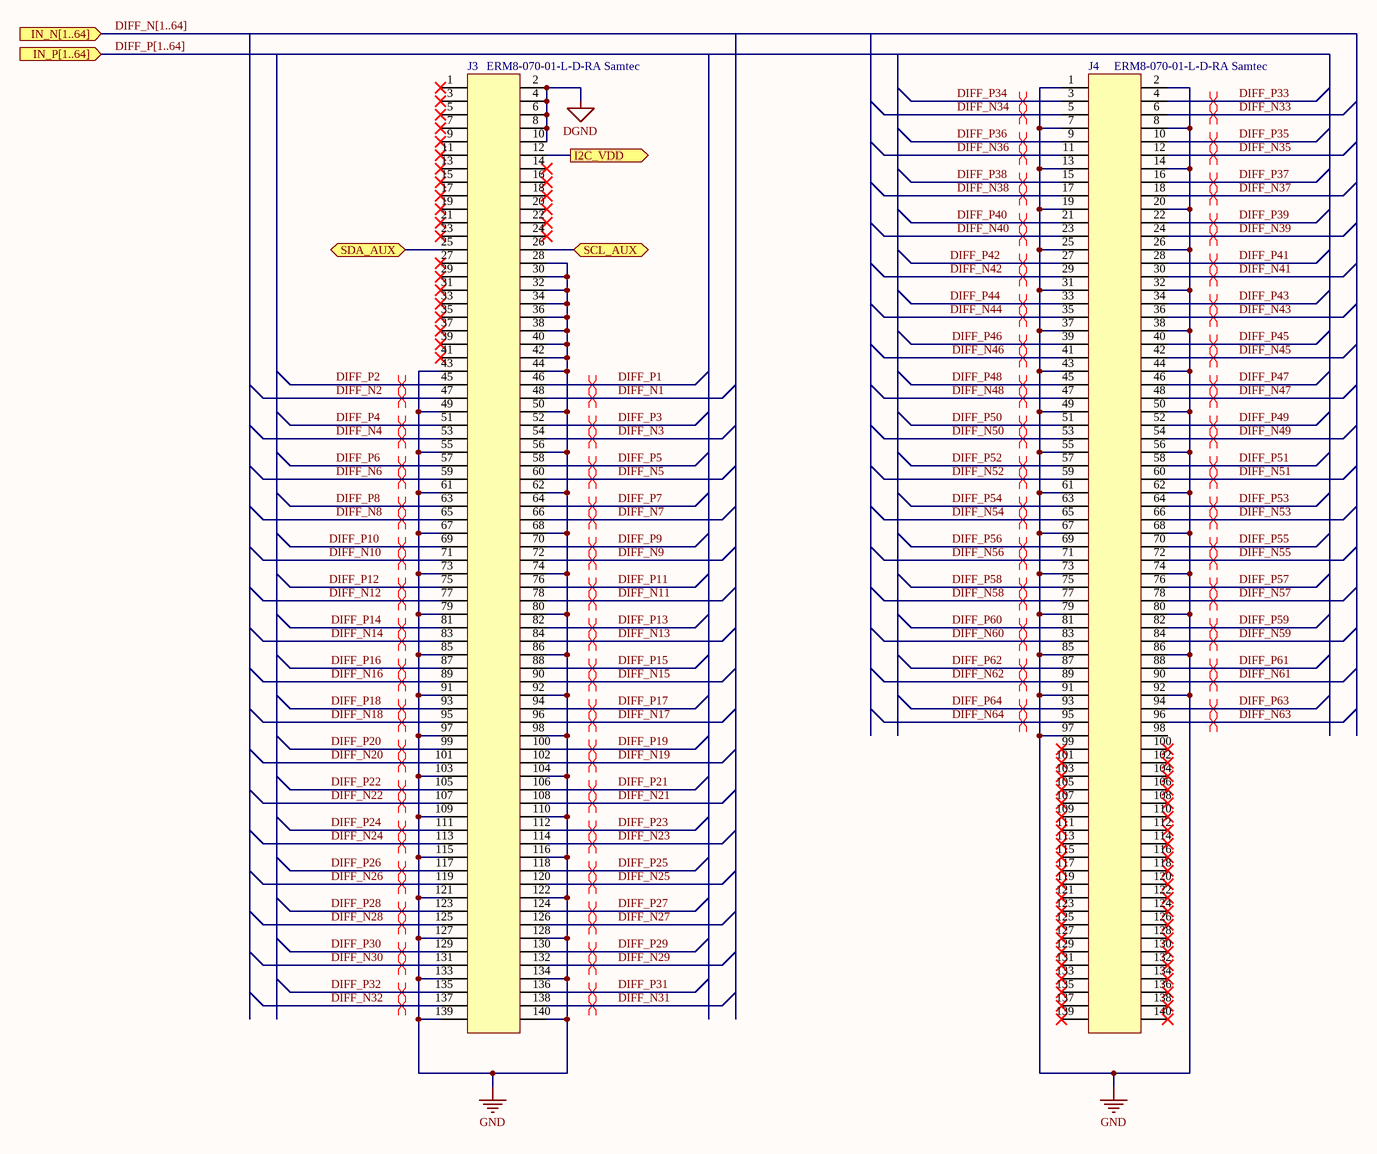
[diagram p2: Output_block.SchDoc]

### Parts
J3  ERM8-070-01-L-D-RA Samtec  [ERM8-070-01-L-D-RA]
J4  ERM8-070-01-L-D-RA Samtec  [ERM8-070-01-L-D-RA]

### Ports
I2C_VDD (out), IN_N[1..64] (in), IN_P[1..64] (in), SCL_AUX (bidir), SDA_AUX (bidir)

### Nets
DGND: J3.2 J3.4 J3.6 J3.8 J3.10
GND: J3.28 J3.30 J3.32 J3.34 J3.36 J3.38 J3.40 J3.42 J3.43 J3.44 J3.49 J3.50 J3.55 J3.56 J3.61 J3.62 J3.67 J3.68 J3.73 J3.74 J3.79 J3.80 J3.85 J3.86 J3.91 J3.92 J3.97 J3.98 J3.103 J3.104 J3.109 J3.110 J3.115 J3.116 J3.121 J3.122 J3.127 J3.128 J3.133 J3.134 J3.139 J3.140 J4.1 J4.2 J4.7 J4.8 J4.13 J4.14 J4.19 J4.20 J4.25 J4.26 J4.31 J4.32 J4.37 J4.38 J4.43 J4.44 J4.49 J4.50 J4.55 J4.56 J4.61 J4.62 J4.67 J4.68 J4.73 J4.74 J4.79 J4.80 J4.85 J4.86 J4.91 J4.92 J4.97
DIFF_N1: J3.48
DIFF_N2: J3.47
DIFF_N3: J3.54
DIFF_N4: J3.53
DIFF_N5: J3.60
DIFF_N6: J3.59
DIFF_N7: J3.66
DIFF_N8: J3.65
DIFF_N9: J3.72
DIFF_N10: J3.71
DIFF_N11: J3.78
DIFF_N12: J3.77
DIFF_N13: J3.84
DIFF_N14: J3.83
DIFF_N15: J3.90
DIFF_N16: J3.89
DIFF_N17: J3.96
DIFF_N18: J3.95
DIFF_N19: J3.102
DIFF_N20: J3.101
DIFF_N21: J3.108
DIFF_N22: J3.107
DIFF_N23: J3.114
DIFF_N24: J3.113
DIFF_N25: J3.120
DIFF_N26: J3.119
DIFF_N27: J3.126
DIFF_N28: J3.125
DIFF_N29: J3.132
DIFF_N30: J3.131
DIFF_N31: J3.138
DIFF_N32: J3.137
DIFF_N33: J4.6
DIFF_N34: J4.5
DIFF_N35: J4.12
DIFF_N36: J4.11
DIFF_N37: J4.18
DIFF_N38: J4.17
DIFF_N39: J4.24
DIFF_N40: J4.23
DIFF_N41: J4.30
DIFF_N42: J4.29
DIFF_N43: J4.36
DIFF_N44: J4.35
DIFF_N45: J4.42
DIFF_N46: J4.41
DIFF_N47: J4.48
DIFF_N48: J4.47
DIFF_N49: J4.54
DIFF_N50: J4.53
DIFF_N51: J4.60
DIFF_N52: J4.59
DIFF_N53: J4.66
DIFF_N54: J4.65
DIFF_N55: J4.72
DIFF_N56: J4.71
DIFF_N57: J4.78
DIFF_N58: J4.77
DIFF_N59: J4.84
DIFF_N60: J4.83
DIFF_N61: J4.90
DIFF_N62: J4.89
DIFF_N63: J4.96
DIFF_N64: J4.95
DIFF_P1: J3.46
DIFF_P2: J3.45
DIFF_P3: J3.52
DIFF_P4: J3.51
DIFF_P5: J3.58
DIFF_P6: J3.57
DIFF_P7: J3.64
DIFF_P8: J3.63
DIFF_P9: J3.70
DIFF_P10: J3.69
DIFF_P11: J3.76
DIFF_P12: J3.75
DIFF_P13: J3.82
DIFF_P14: J3.81
DIFF_P15: J3.88
DIFF_P16: J3.87
DIFF_P17: J3.94
DIFF_P18: J3.93
DIFF_P19: J3.100
DIFF_P20: J3.99
DIFF_P21: J3.106
DIFF_P22: J3.105
DIFF_P23: J3.112
DIFF_P24: J3.111
DIFF_P25: J3.118
DIFF_P26: J3.117
DIFF_P27: J3.124
DIFF_P28: J3.123
DIFF_P29: J3.130
DIFF_P30: J3.129
DIFF_P31: J3.136
DIFF_P32: J3.135
DIFF_P33: J4.4
DIFF_P34: J4.3
DIFF_P35: J4.10
DIFF_P36: J4.9
DIFF_P37: J4.16
DIFF_P38: J4.15
DIFF_P39: J4.22
DIFF_P40: J4.21
DIFF_P41: J4.28
DIFF_P42: J4.27
DIFF_P43: J4.34
DIFF_P44: J4.33
DIFF_P45: J4.40
DIFF_P46: J4.39
DIFF_P47: J4.46
DIFF_P48: J4.45
DIFF_P49: J4.52
DIFF_P50: J4.51
DIFF_P51: J4.58
DIFF_P52: J4.57
DIFF_P53: J4.64
DIFF_P54: J4.63
DIFF_P55: J4.70
DIFF_P56: J4.69
DIFF_P57: J4.76
DIFF_P58: J4.75
DIFF_P59: J4.82
DIFF_P60: J4.81
DIFF_P61: J4.88
DIFF_P62: J4.87
DIFF_P63: J4.94
DIFF_P64: J4.93
NetC47_2: J3.12 ; port I2C_VDD
NetIC9_6: J3.25 ; port SDA_AUX
NetIC9_7: J3.26 ; port SCL_AUX

Not connected (* = marked no-connect by the designer): J3 1* 3* 5* 7* 9* 11* 13* 14* 15* 16* 17* 18* 19* 20* 21* 22* 23* 24* 27* 29* 31* 33* 35* 37* 39* 41*; J4 98 99* 100* 101* 102* 103* 104* 105* 106* 107* 108* 109* 110* 111* 112* 113* 114* 115* 116* 117* 118* 119* 120* 121* 122* 123* 124* 125* 126* 127* 128* 129* 130* 131* 132* 133* 134* 135* 136* 137* 138* 139* 140*

### Buses and harness runs
bus DIFF_N[1..64] = port IN_N[1..64]
bus DIFF_P[1..64] = port IN_P[1..64]

### Layout directives
differential pair: DIFF_N1, DIFF_N2, DIFF_N3, DIFF_N4, DIFF_N5, DIFF_N6, DIFF_N7, DIFF_N8, DIFF_N9, DIFF_N10, DIFF_N11, DIFF_N12, DIFF_N13, DIFF_N14, DIFF_N15, DIFF_N16, DIFF_N17, DIFF_N18, DIFF_N19, DIFF_N20, DIFF_N21, DIFF_N22, DIFF_N23, DIFF_N24, DIFF_N25, DIFF_N26, DIFF_N27, DIFF_N28, DIFF_N29, DIFF_N30, DIFF_N31, DIFF_N32, DIFF_N33, DIFF_N34, DIFF_N35, DIFF_N36, DIFF_N37, DIFF_N38, DIFF_N39, DIFF_N40, DIFF_N41, DIFF_N42, DIFF_N43, DIFF_N44, DIFF_N45, DIFF_N46, DIFF_N47, DIFF_N48, DIFF_N49, DIFF_N50, DIFF_N51, DIFF_N52, DIFF_N53, DIFF_N54, DIFF_N55, DIFF_N56, DIFF_N57, DIFF_N58, DIFF_N59, DIFF_N60, DIFF_N61, DIFF_N62, DIFF_N63, DIFF_N64, DIFF_P1, DIFF_P2, DIFF_P3, DIFF_P4, DIFF_P5, DIFF_P6, DIFF_P7, DIFF_P8, DIFF_P9, DIFF_P10, DIFF_P11, DIFF_P12, DIFF_P13, DIFF_P14, DIFF_P15, DIFF_P16, DIFF_P17, DIFF_P18, DIFF_P19, DIFF_P20, DIFF_P21, DIFF_P22, DIFF_P23, DIFF_P24, DIFF_P25, DIFF_P26, DIFF_P27, DIFF_P28, DIFF_P29, DIFF_P30, DIFF_P31, DIFF_P32, DIFF_P33, DIFF_P34, DIFF_P35, DIFF_P36, DIFF_P37, DIFF_P38, DIFF_P39, DIFF_P40, DIFF_P41, DIFF_P42, DIFF_P43, DIFF_P44, DIFF_P45, DIFF_P46, DIFF_P47, DIFF_P48, DIFF_P49, DIFF_P50, DIFF_P51, DIFF_P52, DIFF_P53, DIFF_P54, DIFF_P55, DIFF_P56, DIFF_P57, DIFF_P58, DIFF_P59, DIFF_P60, DIFF_P61, DIFF_P62, DIFF_P63, DIFF_P64

### Library data of the parts
J3 J4 = ERM8-070-01-L-D-RA: Name: ERM8-070-01-L-D-RA; Manufacturer: Samtec

## Sheet HV_Offset_block.SchDoc
size A4
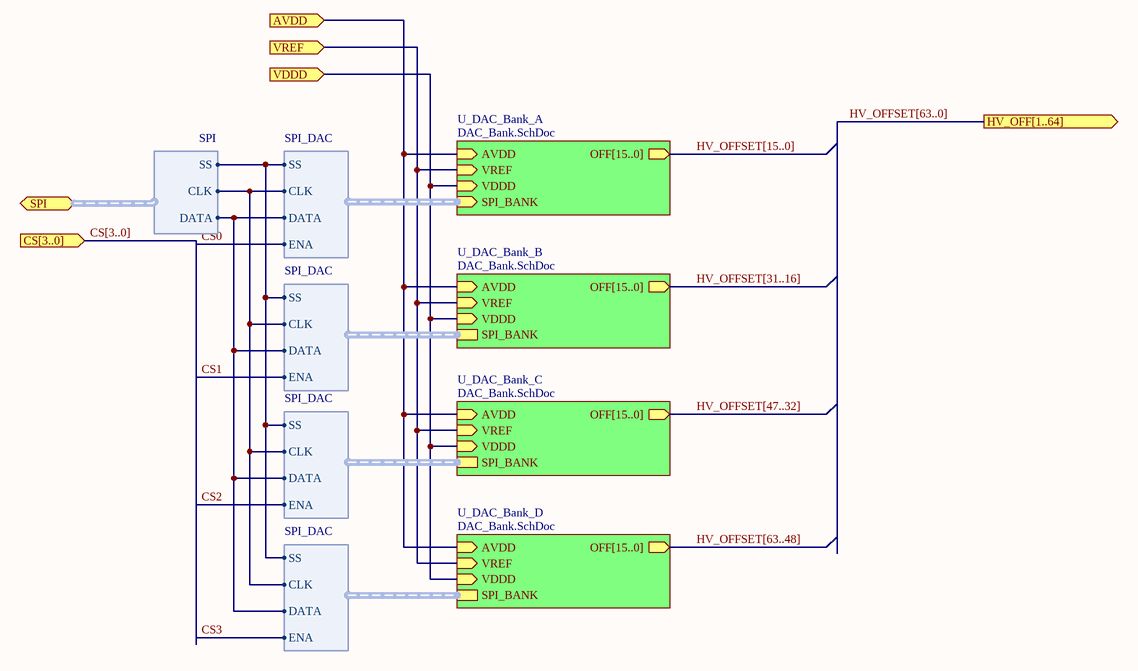
[diagram p3: HV_Offset_block.SchDoc]

### Sub-sheets
U_DAC_Bank_A = DAC_Bank.SchDoc: AVDD (in), VREF (in), VDDD (in), OFF[15..0] (out), SPI_BANK (in, harness SPI_DAC)
U_DAC_Bank_B = DAC_Bank.SchDoc: AVDD (in), VREF (in), VDDD (in), SPI_BANK (harness SPI_DAC), OFF[15..0] (out)
U_DAC_Bank_C = DAC_Bank.SchDoc: AVDD (in), VREF (in), VDDD (in), SPI_BANK (harness SPI_DAC), OFF[15..0] (out)
U_DAC_Bank_D = DAC_Bank.SchDoc: AVDD (in), VREF (in), VDDD (in), SPI_BANK (harness SPI_DAC), OFF[15..0] (out)

### Ports
AVDD (in), CS[3..0] (in), HV_OFF[1..64] (out), SPI (bidir, harness SPI), VDDD (in), VREF (in)

### Harnesses
SPI_DAC: DATA, CLK, SS, ENA
SPI: DATA, CLK, SS

### Nets
VDD: port VDDD, sheet U_DAC_Bank_A/VDDD, sheet U_DAC_Bank_B/VDDD, sheet U_DAC_Bank_C/VDDD, sheet U_DAC_Bank_D/VDDD
NetC12_2: port AVDD, sheet U_DAC_Bank_A/AVDD, sheet U_DAC_Bank_B/AVDD, sheet U_DAC_Bank_C/AVDD, sheet U_DAC_Bank_D/AVDD
NetIC4_1_9: sheet U_DAC_Bank_A/SPI_BANK.SS, port SPI.SS, sheet U_DAC_Bank_B/SPI_BANK.SS, sheet U_DAC_Bank_C/SPI_BANK.SS, sheet U_DAC_Bank_D/SPI_BANK.SS
NetIC4_1_10: sheet U_DAC_Bank_A/SPI_BANK.CLK, port SPI.CLK, sheet U_DAC_Bank_B/SPI_BANK.CLK, sheet U_DAC_Bank_C/SPI_BANK.CLK, sheet U_DAC_Bank_D/SPI_BANK.CLK
NetIC4_1_11: sheet U_DAC_Bank_A/SPI_BANK.DATA, port SPI.DATA, sheet U_DAC_Bank_B/SPI_BANK.DATA, sheet U_DAC_Bank_C/SPI_BANK.DATA, sheet U_DAC_Bank_D/SPI_BANK.DATA
NetL15_2: port VREF, sheet U_DAC_Bank_A/VREF, sheet U_DAC_Bank_B/VREF, sheet U_DAC_Bank_C/VREF, sheet U_DAC_Bank_D/VREF

### Buses and harness runs
bus CS[3..0] = port CS[3..0]
bus HV_OFFSET[15..0] = sheet U_DAC_Bank_A/OFF[15..0]
bus HV_OFFSET[31..16] = sheet U_DAC_Bank_B/OFF[15..0]
bus HV_OFFSET[47..32] = sheet U_DAC_Bank_C/OFF[15..0]
bus HV_OFFSET[63..0] = port HV_OFF[1..64]
bus HV_OFFSET[63..48] = sheet U_DAC_Bank_D/OFF[15..0]

## Sheet DAC_Bank.SchDoc
size A4
Used 4 times, as channels U_HV_Offset_block/U_DAC_Bank_A, U_HV_Offset_block/U_DAC_Bank_B, U_HV_Offset_block/U_DAC_Bank_C, U_HV_Offset_block/U_DAC_Bank_D. Parts and nets are listed once, with the designators drawn on the sheet.
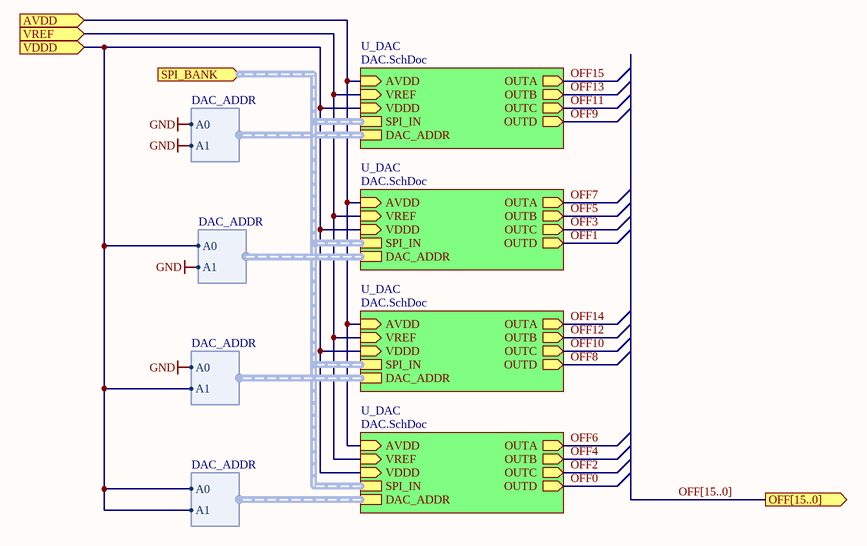
[diagram p4: DAC_Bank.SchDoc]

### Sub-sheets
U_DAC = DAC.SchDoc: AVDD (in), VREF (in), VDDD (in), SPI_IN (harness SPI_DAC), DAC_ADDR (harness DAC_ADDR), OUTA (out), OUTB (out), OUTC (out), OUTD (out)
U_DAC = DAC.SchDoc: AVDD (in), VREF (in), VDDD (in), SPI_IN (harness SPI_DAC), DAC_ADDR (harness DAC_ADDR), OUTA (out), OUTB (out), OUTC (out), OUTD (out)
U_DAC = DAC.SchDoc: AVDD (in), VREF (in), VDDD (in), SPI_IN (harness SPI_DAC), DAC_ADDR (harness DAC_ADDR), OUTA (out), OUTB (out), OUTC (out), OUTD (out)
U_DAC = DAC.SchDoc: AVDD (in), VREF (in), VDDD (in), SPI_IN (harness SPI_DAC), DAC_ADDR (harness DAC_ADDR), OUTA (out), OUTB (out), OUTC (out), OUTD (out)

### Ports
AVDD (in), OFF[15..0] (out), SPI_BANK (in, harness SPI_DAC), VDDD (in), VREF (in)

### Harnesses
DAC_ADDR: A0, A1

### Nets
GND: sheet U_DAC/DAC_ADDR.A0, sheet U_DAC/DAC_ADDR.A1
AVDD: port AVDD, sheet U_DAC/AVDD, sheet U_DAC/AVDD, sheet U_DAC/AVDD, sheet U_DAC/AVDD
OFF0: sheet U_DAC/OUTD
OFF1: sheet U_DAC/OUTD
OFF2: sheet U_DAC/OUTC
OFF3: sheet U_DAC/OUTC
OFF4: sheet U_DAC/OUTB
OFF5: sheet U_DAC/OUTB
OFF6: sheet U_DAC/OUTA
OFF7: sheet U_DAC/OUTA
OFF8: sheet U_DAC/OUTD
OFF9: sheet U_DAC/OUTD
OFF10: sheet U_DAC/OUTC
OFF11: sheet U_DAC/OUTC
OFF12: sheet U_DAC/OUTB
OFF13: sheet U_DAC/OUTB
OFF14: sheet U_DAC/OUTA
OFF15: sheet U_DAC/OUTA
VDDD: port VDDD, sheet U_DAC/VDDD, sheet U_DAC/VDDD, sheet U_DAC/VDDD, sheet U_DAC/VDDD, sheet U_DAC/DAC_ADDR.A0, sheet U_DAC/DAC_ADDR.A1
VREF: port VREF, sheet U_DAC/VREF, sheet U_DAC/VREF, sheet U_DAC/VREF, sheet U_DAC/VREF

### Channels
U_HV_Offset_block/U_DAC_Bank_A: ports AVDD=NetC12_2 VDDD=VDD VREF=NetL15_2
U_HV_Offset_block/U_DAC_Bank_B: ports AVDD=NetC12_2 VDDD=VDD VREF=NetL15_2
U_HV_Offset_block/U_DAC_Bank_C: ports AVDD=NetC12_2 VDDD=VDD VREF=NetL15_2
U_HV_Offset_block/U_DAC_Bank_D: ports AVDD=NetC12_2 VDDD=VDD VREF=NetL15_2

### Buses and harness runs
bus OFF[15..0] = port OFF[15..0]
harness port SPI_BANK = sheet U_DAC/SPI_IN

## Sheet DAC.SchDoc
size A4
Used 16 times, as channels U_HV_Offset_block/U_DAC_Bank_A/U_DAC, U_HV_Offset_block/U_DAC_Bank_A/U_DAC, U_HV_Offset_block/U_DAC_Bank_A/U_DAC, U_HV_Offset_block/U_DAC_Bank_A/U_DAC, U_HV_Offset_block/U_DAC_Bank_B/U_DAC, U_HV_Offset_block/U_DAC_Bank_B/U_DAC, U_HV_Offset_block/U_DAC_Bank_B/U_DAC, U_HV_Offset_block/U_DAC_Bank_B/U_DAC, U_HV_Offset_block/U_DAC_Bank_C/U_DAC, U_HV_Offset_block/U_DAC_Bank_C/U_DAC, U_HV_Offset_block/U_DAC_Bank_C/U_DAC, U_HV_Offset_block/U_DAC_Bank_C/U_DAC, U_HV_Offset_block/U_DAC_Bank_D/U_DAC, U_HV_Offset_block/U_DAC_Bank_D/U_DAC, U_HV_Offset_block/U_DAC_Bank_D/U_DAC, U_HV_Offset_block/U_DAC_Bank_D/U_DAC. Parts and nets are listed once, with the designators drawn on the sheet.
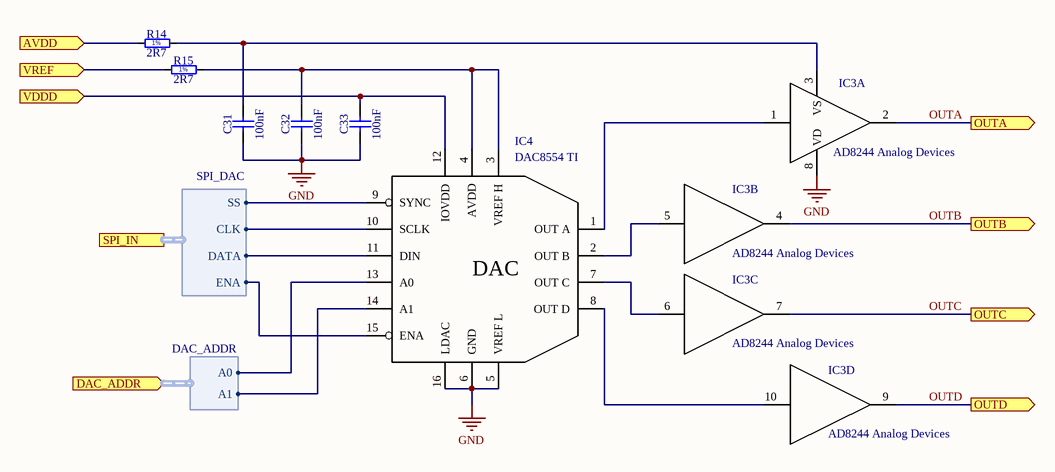
[diagram p5: DAC.SchDoc]

### Parts
C31  100nF  [CAPC2012X135N]
C32  100nF  [CAPC2012X135N]
C33  100nF  [CAPC2012X135N]
IC3  AD8244 Analog Devices  [TSSOP50P490X110-10N]  (parts A,B,C,D of 4)
IC4  DAC8554 TI  [TSOP65P640X120-16N]
R14  2R7  [RESC2012X60N]
R15  2R7  [RESC2012X60N]

### Ports
AVDD (in), DAC_ADDR (in, harness DAC_ADDR), OUTA (out), OUTB (out), OUTC (out), OUTD (out), SPI_IN (harness SPI_DAC), VDDD (in), VREF (in)

### Harnesses
SPI_DAC: DATA, CLK, SS, ENA
DAC_ADDR: A0, A1

### Nets
GND: C31.1 C32.1 C33.1 IC3.8(VD) IC4.5(VREF_L) IC4.6(GND) IC4.16(LDAC)
AVDD: R14.1 ; port AVDD
OUTA: IC3.2(OUT_A) ; port OUTA
OUTB: IC3.4(OUT_B) ; port OUTB
OUTC: IC3.7(OUT_C) ; port OUTC
OUTD: IC3.9(OUT_D) ; port OUTD
VDDD: C33.2 IC4.12(IOVDD) ; port VDDD
VREF: R15.1 ; port VREF
NetC31_2: C31.2 IC3.3(VS) R14.2
NetC32_2: C32.2 IC4.3(VREF_H) IC4.4(AVDD) R15.2
NetIC3_1: IC3.1(IN_A) IC4.1(OUT_A)
NetIC3_5: IC3.5(IN_B) IC4.2(OUT_B)
NetIC3_6: IC3.6(IN_C) IC4.7(OUT_C)
NetIC3_10: IC3.10(IN_D) IC4.8(OUT_D)
NetIC4_9: IC4.9(SYNC) ; port SPI_IN.SS
NetIC4_10: IC4.10(SCLK) ; port SPI_IN.CLK
NetIC4_11: IC4.11(DIN) ; port SPI_IN.DATA
NetIC4_13: IC4.13(A0) ; port DAC_ADDR.A0
NetIC4_14: IC4.14(A1) ; port DAC_ADDR.A1
NetIC4_15: IC4.15(ENA) ; port SPI_IN.ENA

### Channels
U_HV_Offset_block/U_DAC_Bank_A/U_DAC: designators end in _1; ports AVDD=NetC12_2 OUTA=HV_OFF49 OUTB=HV_OFF51 OUTC=HV_OFF53 OUTD=HV_OFF55 VDDD=VDD VREF=NetL15_2
U_HV_Offset_block/U_DAC_Bank_A/U_DAC: designators end in _2; ports AVDD=NetC12_2 OUTA=HV_OFF57 OUTB=HV_OFF59 OUTC=HV_OFF61 OUTD=HV_OFF63 VDDD=VDD VREF=NetL15_2
U_HV_Offset_block/U_DAC_Bank_A/U_DAC: designators end in _3; ports AVDD=NetC12_2 OUTA=HV_OFF50 OUTB=HV_OFF52 OUTC=HV_OFF54 OUTD=HV_OFF56 VDDD=VDD VREF=NetL15_2
U_HV_Offset_block/U_DAC_Bank_A/U_DAC: designators end in _4; ports AVDD=NetC12_2 OUTA=HV_OFF58 OUTB=HV_OFF60 OUTC=HV_OFF62 OUTD=HV_OFF64 VDDD=VDD VREF=NetL15_2
U_HV_Offset_block/U_DAC_Bank_B/U_DAC: designators end in _5; ports AVDD=NetC12_2 OUTA=HV_OFF33 OUTB=HV_OFF35 OUTC=HV_OFF37 OUTD=HV_OFF39 VDDD=VDD VREF=NetL15_2
U_HV_Offset_block/U_DAC_Bank_B/U_DAC: designators end in _6; ports AVDD=NetC12_2 OUTA=HV_OFF41 OUTB=HV_OFF43 OUTC=HV_OFF45 OUTD=HV_OFF47 VDDD=VDD VREF=NetL15_2
U_HV_Offset_block/U_DAC_Bank_B/U_DAC: designators end in _7; ports AVDD=NetC12_2 OUTA=HV_OFF34 OUTB=HV_OFF36 OUTC=HV_OFF38 OUTD=HV_OFF40 VDDD=VDD VREF=NetL15_2
U_HV_Offset_block/U_DAC_Bank_B/U_DAC: designators end in _8; ports AVDD=NetC12_2 OUTA=HV_OFF42 OUTB=HV_OFF44 OUTC=HV_OFF46 OUTD=HV_OFF48 VDDD=VDD VREF=NetL15_2
U_HV_Offset_block/U_DAC_Bank_C/U_DAC: designators end in _9; ports AVDD=NetC12_2 OUTA=HV_OFF17 OUTB=HV_OFF19 OUTC=HV_OFF21 OUTD=HV_OFF23 VDDD=VDD VREF=NetL15_2
U_HV_Offset_block/U_DAC_Bank_C/U_DAC: designators end in _10; ports AVDD=NetC12_2 OUTA=HV_OFF25 OUTB=HV_OFF27 OUTC=HV_OFF29 OUTD=HV_OFF31 VDDD=VDD VREF=NetL15_2
U_HV_Offset_block/U_DAC_Bank_C/U_DAC: designators end in _11; ports AVDD=NetC12_2 OUTA=HV_OFF18 OUTB=HV_OFF20 OUTC=HV_OFF22 OUTD=HV_OFF24 VDDD=VDD VREF=NetL15_2
U_HV_Offset_block/U_DAC_Bank_C/U_DAC: designators end in _12; ports AVDD=NetC12_2 OUTA=HV_OFF26 OUTB=HV_OFF28 OUTC=HV_OFF30 OUTD=HV_OFF32 VDDD=VDD VREF=NetL15_2
U_HV_Offset_block/U_DAC_Bank_D/U_DAC: designators end in _13; ports AVDD=NetC12_2 OUTA=HV_OFF1 OUTB=HV_OFF3 OUTC=HV_OFF5 OUTD=HV_OFF7 VDDD=VDD VREF=NetL15_2
U_HV_Offset_block/U_DAC_Bank_D/U_DAC: designators end in _14; ports AVDD=NetC12_2 OUTA=HV_OFF9 OUTB=HV_OFF11 OUTC=HV_OFF13 OUTD=HV_OFF15 VDDD=VDD VREF=NetL15_2
U_HV_Offset_block/U_DAC_Bank_D/U_DAC: designators end in _15; ports AVDD=NetC12_2 OUTA=HV_OFF2 OUTB=HV_OFF4 OUTC=HV_OFF6 OUTD=HV_OFF8 VDDD=VDD VREF=NetL15_2
U_HV_Offset_block/U_DAC_Bank_D/U_DAC: designators end in _16; ports AVDD=NetC12_2 OUTA=HV_OFF10 OUTB=HV_OFF12 OUTC=HV_OFF14 OUTD=HV_OFF16 VDDD=VDD VREF=NetL15_2

### Notes on the sheet
- (in symbol DAC8554) DAC
- (in symbol R0805_2R7_1%_0.125W_200PPM) 1%

### Library data of the parts
C31-C33 = CC0805_100NF_50V_10%_X7R: Non-polarised capacitor; Part Description: SMD Multilayer Chip Ceramic Capacitor; Manufacturer: GENERIC; Manufacturer1 Part Number: C2012X7R1H104K085AA; Voltage: 50V; TC: X7R; Tolerance: ±10%; Part Number: CC0805_100NF_50V_10%_X7R; Component Kind: Standard; Component Type: Standard; Pin Count: 2; Value: 100nF; Status: Preferred; Manufacturer Part Number: CC0805_100NF_50V_10%_X7R; Case: 0805; Mounted: Yes; Socket: No; SMD: Yes; Sense: No; Manufacturer1 Example: TDK; Manufacturer1 ComponentHeight: 1mm; HelpURL: \\cern.ch\dfs\Applications\Altium\Datasheets\CC0805_X7R_TDK_C.pdf; Author: CERN DEM JLC; CreateDate: 03.12.2007; LatestRevisionDate: 22.04.2015
IC3 = AD8244: Name: AD8244; Manufacturer: Analog Devices
IC4 = DAC8554: Name: DAC8554; Manufacturer: TI
R14 R15 = R0805_2R7_1%_0.125W_200PPM: as R7_CH64 on sheet Channel; Part Number: R0805_2R7_1%_0.125W_200PPM; Component Kind: Standard; Component Type: Standard; Pin Count: 2; Value: 2R7; Status: Preferred; Tolerance: ±1%; Manufacturer Part Number: R0805_2R7_1%_0.125W_200PPM; Case: 0805; Mounted: Yes; Sense: No; Socket: No; SMD: Yes; Manufacturer1 Example: YAGEO PHYCOMP; Manufacturer1 ComponentHeight: 0.65mm; HelpURL: \\cern.ch\dfs\Applications\Altium\Datasheets\R0805_Phycomp_RC0805.pdf; Author: CERN DEM JLC; CreateDate: 03.12.2007; LatestRevisionDate: 17.10.2012

## Sheet Input_block.SchDoc
size A4
Used 64 times, as channels IJ1, IJ2, IJ3, IJ4, IJ5, IJ6, IJ7, IJ8, IJ9, IJ10, IJ11, IJ12, IJ13, IJ14, IJ15, IJ16, IJ17, IJ18, IJ19, IJ20, IJ21, IJ22, IJ23, IJ24, IJ25, IJ26, IJ27, IJ28, IJ29, IJ30, IJ31, IJ32, IJ33, IJ34, IJ35, IJ36, IJ37, IJ38, IJ39, IJ40, IJ41, IJ42, IJ43, IJ44, IJ45, IJ46, IJ47, IJ48, IJ49, IJ50, IJ51, IJ52, IJ53, IJ54, IJ55, IJ56, IJ57, IJ58, IJ59, IJ60, IJ61, IJ62, IJ63, IJ64. Parts and nets are listed once, with the designators drawn on the sheet.
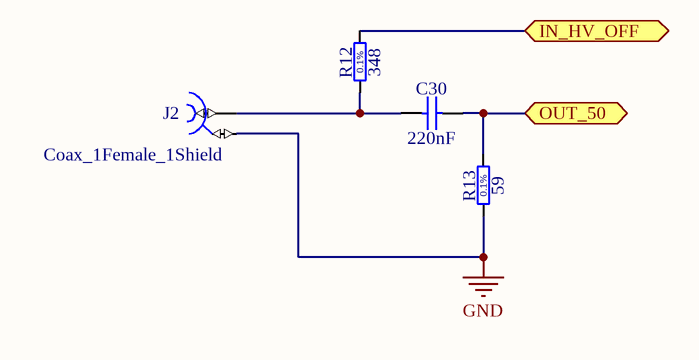
[diagram p6: Input_block.SchDoc]

### Parts
C30  220nF  [CAPC2012X135N]
J2  Coax_1Female_1Shield  [SAMTEC_MMCX-J-P-H-ST-TH1]
R12  348  [RESC2012X60N]
R13  59  [RESC2012X60N]

### Ports
IN_HV_OFF (bidir), OUT_50 (bidir)

### Nets
GND: J2.2 R13.1
IN_HV_OFF: R12.2 ; port IN_HV_OFF
OUT_50: C30.2 R13.2 ; port OUT_50
NetC30_1: C30.1 J2.1 R12.1

### Channels
IJ1: designators end in _1; ports IN_HV_OFF=HV_OFF1 OUT_50=O1
IJ2: designators end in _2; ports IN_HV_OFF=HV_OFF2 OUT_50=O2
IJ3: designators end in _3; ports IN_HV_OFF=HV_OFF3 OUT_50=O3
IJ4: designators end in _4; ports IN_HV_OFF=HV_OFF4 OUT_50=O4
IJ5: designators end in _5; ports IN_HV_OFF=HV_OFF5 OUT_50=O5
IJ6: designators end in _6; ports IN_HV_OFF=HV_OFF6 OUT_50=O6
IJ7: designators end in _7; ports IN_HV_OFF=HV_OFF7 OUT_50=O7
IJ8: designators end in _8; ports IN_HV_OFF=HV_OFF8 OUT_50=O8
IJ9: designators end in _9; ports IN_HV_OFF=HV_OFF9 OUT_50=O9
IJ10: designators end in _10; ports IN_HV_OFF=HV_OFF10 OUT_50=O10
IJ11: designators end in _11; ports IN_HV_OFF=HV_OFF11 OUT_50=O11
IJ12: designators end in _12; ports IN_HV_OFF=HV_OFF12 OUT_50=O12
IJ13: designators end in _13; ports IN_HV_OFF=HV_OFF13 OUT_50=O13
IJ14: designators end in _14; ports IN_HV_OFF=HV_OFF14 OUT_50=O14
IJ15: designators end in _15; ports IN_HV_OFF=HV_OFF15 OUT_50=O15
IJ16: designators end in _16; ports IN_HV_OFF=HV_OFF16 OUT_50=O16
IJ17: designators end in _17; ports IN_HV_OFF=HV_OFF17 OUT_50=O17
IJ18: designators end in _18; ports IN_HV_OFF=HV_OFF18 OUT_50=O18
IJ19: designators end in _19; ports IN_HV_OFF=HV_OFF19 OUT_50=O19
IJ20: designators end in _20; ports IN_HV_OFF=HV_OFF20 OUT_50=O20
IJ21: designators end in _21; ports IN_HV_OFF=HV_OFF21 OUT_50=O21
IJ22: designators end in _22; ports IN_HV_OFF=HV_OFF22 OUT_50=O22
IJ23: designators end in _23; ports IN_HV_OFF=HV_OFF23 OUT_50=O23
IJ24: designators end in _24; ports IN_HV_OFF=HV_OFF24 OUT_50=O24
IJ25: designators end in _25; ports IN_HV_OFF=HV_OFF25 OUT_50=O25
IJ26: designators end in _26; ports IN_HV_OFF=HV_OFF26 OUT_50=O26
IJ27: designators end in _27; ports IN_HV_OFF=HV_OFF27 OUT_50=O27
IJ28: designators end in _28; ports IN_HV_OFF=HV_OFF28 OUT_50=O28
IJ29: designators end in _29; ports IN_HV_OFF=HV_OFF29 OUT_50=O29
IJ30: designators end in _30; ports IN_HV_OFF=HV_OFF30 OUT_50=O30
IJ31: designators end in _31; ports IN_HV_OFF=HV_OFF31 OUT_50=O31
IJ32: designators end in _32; ports IN_HV_OFF=HV_OFF32 OUT_50=O32
IJ33: designators end in _33; ports IN_HV_OFF=HV_OFF33 OUT_50=O33
IJ34: designators end in _34; ports IN_HV_OFF=HV_OFF34 OUT_50=O34
IJ35: designators end in _35; ports IN_HV_OFF=HV_OFF35 OUT_50=O35
IJ36: designators end in _36; ports IN_HV_OFF=HV_OFF36 OUT_50=O36
IJ37: designators end in _37; ports IN_HV_OFF=HV_OFF37 OUT_50=O37
IJ38: designators end in _38; ports IN_HV_OFF=HV_OFF38 OUT_50=O38
IJ39: designators end in _39; ports IN_HV_OFF=HV_OFF39 OUT_50=O39
IJ40: designators end in _40; ports IN_HV_OFF=HV_OFF40 OUT_50=O40
IJ41: designators end in _41; ports IN_HV_OFF=HV_OFF41 OUT_50=O41
IJ42: designators end in _42; ports IN_HV_OFF=HV_OFF42 OUT_50=O42
IJ43: designators end in _43; ports IN_HV_OFF=HV_OFF43 OUT_50=O43
IJ44: designators end in _44; ports IN_HV_OFF=HV_OFF44 OUT_50=O44
IJ45: designators end in _45; ports IN_HV_OFF=HV_OFF45 OUT_50=O45
IJ46: designators end in _46; ports IN_HV_OFF=HV_OFF46 OUT_50=O46
IJ47: designators end in _47; ports IN_HV_OFF=HV_OFF47 OUT_50=O47
IJ48: designators end in _48; ports IN_HV_OFF=HV_OFF48 OUT_50=O48
IJ49: designators end in _49; ports IN_HV_OFF=HV_OFF49 OUT_50=O49
IJ50: designators end in _50; ports IN_HV_OFF=HV_OFF50 OUT_50=O50
IJ51: designators end in _51; ports IN_HV_OFF=HV_OFF51 OUT_50=O51
IJ52: designators end in _52; ports IN_HV_OFF=HV_OFF52 OUT_50=O52
IJ53: designators end in _53; ports IN_HV_OFF=HV_OFF53 OUT_50=O53
IJ54: designators end in _54; ports IN_HV_OFF=HV_OFF54 OUT_50=O54
IJ55: designators end in _55; ports IN_HV_OFF=HV_OFF55 OUT_50=O55
IJ56: designators end in _56; ports IN_HV_OFF=HV_OFF56 OUT_50=O56
IJ57: designators end in _57; ports IN_HV_OFF=HV_OFF57 OUT_50=O57
IJ58: designators end in _58; ports IN_HV_OFF=HV_OFF58 OUT_50=O58
IJ59: designators end in _59; ports IN_HV_OFF=HV_OFF59 OUT_50=O59
IJ60: designators end in _60; ports IN_HV_OFF=HV_OFF60 OUT_50=O60
IJ61: designators end in _61; ports IN_HV_OFF=HV_OFF61 OUT_50=O61
IJ62: designators end in _62; ports IN_HV_OFF=HV_OFF62 OUT_50=O62
IJ63: designators end in _63; ports IN_HV_OFF=HV_OFF63 OUT_50=O63
IJ64: designators end in _64; ports IN_HV_OFF=HV_OFF64 OUT_50=O64

### Notes on the sheet
- (in symbol R0805_59R_0.1%_0.1W_10PPM) 0.1%
- (in symbol R0805_348R_0.1%_0.1W_10PPM) 0.1%

### Library data of the parts
C30 = CC0805_220NF_50V_10%_X7R: Non-polarised capacitor; Part Description: SMD Multilayer Chip Ceramic Capacitor; Manufacturer: GENERIC; Manufacturer1 Part Number: GRM21BR71H224KA01L; Voltage: 50V; TC: X7R; Tolerance: ±10%; Part Number: CC0805_220NF_50V_10%_X7R; Component Kind: Standard; Component Type: Standard; Pin Count: 2; Value: 220nF; Status: Preferred; Manufacturer Part Number: CC0805_220NF_50V_10%_X7R; Case: 0805; Mounted: Yes; Socket: No; SMD: Yes; Sense: No; Manufacturer1 Example: MURATA; Manufacturer1 ComponentHeight: 1.35mm; HelpURL: \\cern.ch\dfs\Applications\Altium\Datasheets\CC0805_X7R_MURATA.pdf; Author: CERN DEM JLC; CreateDate: 03.12.2007; LatestRevisionDate: 03.12.2007
J2 = SAMTEC_MMCX-J-P-H-ST-TH1: Part Description: Straight Through-hole 50 Ohm Micro Mini RF Jack, MMCX Series; Manufacturer: SAMTEC; PressFit: No; Part Number: SAMTEC_MMCX-J-P-H-ST-TH1; Component Kind: Standard; Component Type: Standard; Pin Count: 2; Mounted: Yes; Socket: No; Sense: No; SMD: No; Status: None; Manufacturer Part Number: MMCX-J-P-H-ST-TH1; ComponentHeight: 4.35mm; HelpURL: \\cern.ch\dfs\Applications\Altium\Datasheets\SAMTEC_MMCX-J-P-H-ST-TH1.pdf; Author: CERN DEM JLC; CreateDate: 05.12.2012; LatestRevisionDate: 05.12.2012
R12 = R0805_348R_0.1%_0.1W_10PPM: Resistor - 0.1%; Part Description: Thin Film Chip Resistor; Manufacturer: GENERIC; Manufacturer1 Part Number: RN73C2A348RBTG; Power: 0.1W; TC: ±10ppm; PressFit: No; Part Number: R0805_348R_0.1%_0.1W_10PPM; Component Kind: Standard; Component Type: Standard; Pin Count: 2; Value: 348; Status: Not Recommended; Tolerance: ±0.1%; Manufacturer Part Number: R0805_348R_0.1%_0.1W_10PPM; Case: 0805; Mounted: Yes; Sense: No; Socket: No; SMD: Yes; Manufacturer1 Example: TYCO HOLSWORTHY; Manufacturer1 ComponentHeight: 0.6mm; HelpURL: \\cern.ch\dfs\Applications\Altium\Datasheets\R0805_Tyco_RN73.pdf; Author: CERN DEM JLC; CreateDate: 03.12.2007; LatestRevisionDate: 13.03.2008
R13 = R0805_59R_0.1%_0.1W_10PPM: Resistor - 0.1%; Part Description: Thin Film Chip Resistor; Manufacturer: GENERIC; Manufacturer1 Part Number: RN73C2A59RBTG; Power: 0.1W; TC: ±10ppm; PressFit: No; Part Number: R0805_59R_0.1%_0.1W_10PPM; Component Kind: Standard; Component Type: Standard; Pin Count: 2; Value: 59; Status: Not Recommended; Tolerance: ±0.1%; Manufacturer Part Number: R0805_59R_0.1%_0.1W_10PPM; Case: 0805; Mounted: Yes; Sense: No; Socket: No; SMD: Yes; Manufacturer1 Example: TYCO HOLSWORTHY; Manufacturer1 ComponentHeight: 0.6mm; HelpURL: \\cern.ch\dfs\Applications\Altium\Datasheets\R0805_Tyco_RN73.pdf; Author: CERN DEM JLC; CreateDate: 03.12.2007; LatestRevisionDate: 13.03.2008